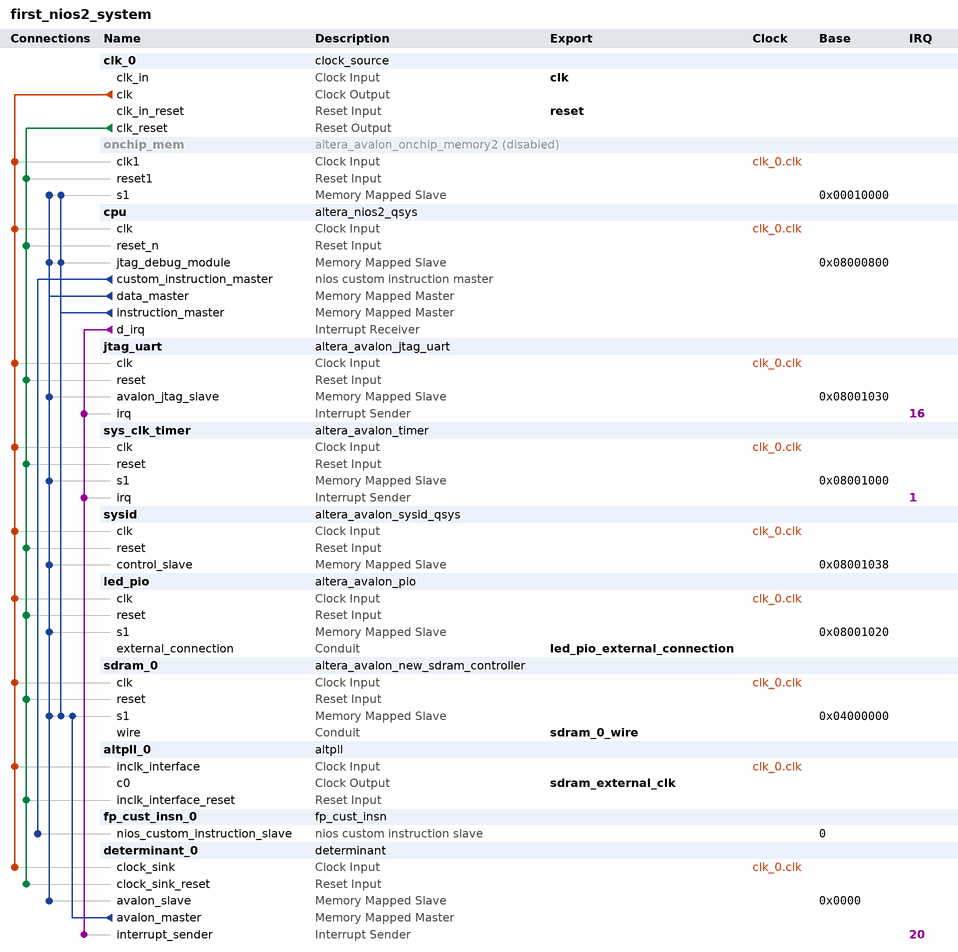
[diagram p0: system contents]
# Platform Designer (Qsys) system first_nios2_system, Cyclone III EP3C16F484C6
# Parameters at their usual value, and those the tool derives, are not listed.
package require -exact qsys 12.1
create_system first_nios2_system
set_project_property DEVICE_FAMILY {Cyclone III}
set_project_property DEVICE EP3C16F484C6

add_instance clk_0 clock_source 12.1
set_instance_parameter_value clk_0 clockFrequency 50000000

add_instance onchip_mem altera_avalon_onchip_memory2 12.1
set_instance_property onchip_mem ENABLED false
set_instance_parameter_value onchip_mem dataWidth 32
set_instance_parameter_value onchip_mem dualPort false
set_instance_parameter_value onchip_mem initMemContent true
set_instance_parameter_value onchip_mem initializationFileName onchip_mem
set_instance_parameter_value onchip_mem memorySize 20480

add_instance cpu altera_nios2_qsys 12.1
set_instance_parameter_value cpu resetSlave sdram_0.s1
set_instance_parameter_value cpu exceptionSlave sdram_0.s1
set_instance_parameter_value cpu breakSlave cpu.jtag_debug_module
set_instance_parameter_value cpu impl Small
set_instance_parameter_value cpu icache_size 2048

add_instance jtag_uart altera_avalon_jtag_uart 12.1
set_instance_parameter_value jtag_uart simInteractiveOptions INTERACTIVE_ASCII_OUTPUT

add_instance sys_clk_timer altera_avalon_timer 12.1
set_instance_parameter_value sys_clk_timer period 1
set_instance_parameter_value sys_clk_timer periodUnits MSEC
set_instance_parameter_value sys_clk_timer timerPreset FULL_FEATURED

add_instance sysid altera_avalon_sysid_qsys 12.1
set_instance_parameter_value sysid id 0

add_instance led_pio altera_avalon_pio 12.1
set_instance_parameter_value led_pio direction Output
set_instance_parameter_value led_pio width 10

add_instance sdram_0 altera_avalon_new_sdram_controller 12.1
set_instance_parameter_value sdram_0 TAC 5.5
set_instance_parameter_value sdram_0 TRCD 20.0
set_instance_parameter_value sdram_0 TRP 20.0
set_instance_parameter_value sdram_0 casLatency 3
set_instance_parameter_value sdram_0 columnWidth 8
set_instance_parameter_value sdram_0 dataWidth 16
set_instance_parameter_value sdram_0 generateSimulationModel false
set_instance_parameter_value sdram_0 model custom
set_instance_parameter_value sdram_0 numberOfBanks 4
set_instance_parameter_value sdram_0 numberOfChipSelects 1
set_instance_parameter_value sdram_0 powerUpDelay 100.0
set_instance_parameter_value sdram_0 refreshPeriod 15.625
set_instance_parameter_value sdram_0 rowWidth 12

add_instance altpll_0 altpll 12.1
set_instance_parameter_value altpll_0 INCLK0_INPUT_FREQUENCY 20000
set_instance_parameter_value altpll_0 GATE_LOCK_SIGNAL NO
set_instance_parameter_value altpll_0 VALID_LOCK_MULTIPLIER 1
set_instance_parameter_value altpll_0 INVALID_LOCK_MULTIPLIER 5
set_instance_parameter_value altpll_0 CLK0_MULTIPLY_BY 1
set_instance_parameter_value altpll_0 CLK0_DIVIDE_BY 1
set_instance_parameter_value altpll_0 CLK0_PHASE_SHIFT -2550
set_instance_parameter_value altpll_0 PORT_clk1 PORT_UNUSED
set_instance_parameter_value altpll_0 PORT_clk2 PORT_UNUSED
set_instance_parameter_value altpll_0 PORT_clk3 PORT_UNUSED
set_instance_parameter_value altpll_0 PORT_ARESET PORT_UNUSED
set_instance_parameter_value altpll_0 PORT_LOCKED PORT_UNUSED

add_instance fp_cust_insn_0 fp_cust_insn 1.0
set_instance_parameter_value fp_cust_insn_0 fp_add_latency 7
set_instance_parameter_value fp_cust_insn_0 fp_sub_latency 7
set_instance_parameter_value fp_cust_insn_0 fp_mul_latency 5
set_instance_parameter_value fp_cust_insn_0 add_opcode 0
set_instance_parameter_value fp_cust_insn_0 sub_opcode 1
set_instance_parameter_value fp_cust_insn_0 mul_opcode 2

add_instance determinant_0 determinant 1.0

# connections
add_connection clk_0.clk altpll_0.inclk_interface clock
add_connection clk_0.clk cpu.clk clock
add_connection clk_0.clk determinant_0.clock_sink clock
add_connection clk_0.clk jtag_uart.clk clock
add_connection clk_0.clk led_pio.clk clock
add_connection clk_0.clk onchip_mem.clk1 clock
add_connection clk_0.clk sdram_0.clk clock
add_connection clk_0.clk sys_clk_timer.clk clock
add_connection clk_0.clk sysid.clk clock
add_connection clk_0.clk_reset altpll_0.inclk_interface_reset reset
add_connection clk_0.clk_reset cpu.reset_n reset
add_connection clk_0.clk_reset determinant_0.clock_sink_reset reset
add_connection clk_0.clk_reset jtag_uart.reset reset
add_connection clk_0.clk_reset led_pio.reset reset
add_connection clk_0.clk_reset onchip_mem.reset1 reset
add_connection clk_0.clk_reset sdram_0.reset reset
add_connection clk_0.clk_reset sys_clk_timer.reset reset
add_connection clk_0.clk_reset sysid.reset reset
add_connection cpu.data_master cpu.jtag_debug_module avalon
set_connection_parameter_value cpu.data_master/cpu.jtag_debug_module baseAddress 0x08000800
add_connection cpu.data_master determinant_0.avalon_slave avalon
set_connection_parameter_value cpu.data_master/determinant_0.avalon_slave baseAddress 0x0000
add_connection cpu.data_master jtag_uart.avalon_jtag_slave avalon
set_connection_parameter_value cpu.data_master/jtag_uart.avalon_jtag_slave baseAddress 0x08001030
add_connection cpu.data_master led_pio.s1 avalon
set_connection_parameter_value cpu.data_master/led_pio.s1 baseAddress 0x08001020
add_connection cpu.data_master onchip_mem.s1 avalon
set_connection_parameter_value cpu.data_master/onchip_mem.s1 baseAddress 0x00010000
add_connection cpu.data_master sdram_0.s1 avalon
set_connection_parameter_value cpu.data_master/sdram_0.s1 baseAddress 0x04000000
add_connection cpu.data_master sys_clk_timer.s1 avalon
set_connection_parameter_value cpu.data_master/sys_clk_timer.s1 baseAddress 0x08001000
add_connection cpu.data_master sysid.control_slave avalon
set_connection_parameter_value cpu.data_master/sysid.control_slave baseAddress 0x08001038
add_connection cpu.instruction_master cpu.jtag_debug_module avalon
set_connection_parameter_value cpu.instruction_master/cpu.jtag_debug_module baseAddress 0x08000800
add_connection cpu.instruction_master onchip_mem.s1 avalon
set_connection_parameter_value cpu.instruction_master/onchip_mem.s1 baseAddress 0x00010000
add_connection cpu.instruction_master sdram_0.s1 avalon
set_connection_parameter_value cpu.instruction_master/sdram_0.s1 baseAddress 0x04000000
add_connection determinant_0.avalon_master sdram_0.s1 avalon
set_connection_parameter_value determinant_0.avalon_master/sdram_0.s1 baseAddress 0x04000000
add_connection cpu.d_irq determinant_0.interrupt_sender interrupt
set_connection_parameter_value cpu.d_irq/determinant_0.interrupt_sender irqNumber 20
add_connection cpu.d_irq jtag_uart.irq interrupt
set_connection_parameter_value cpu.d_irq/jtag_uart.irq irqNumber 16
add_connection cpu.d_irq sys_clk_timer.irq interrupt
set_connection_parameter_value cpu.d_irq/sys_clk_timer.irq irqNumber 1
add_connection cpu.custom_instruction_master fp_cust_insn_0.nios_custom_instruction_slave nios_custom_instruction
set_connection_parameter_value cpu.custom_instruction_master/fp_cust_insn_0.nios_custom_instruction_slave CIName fp_cust_insn_0
set_connection_parameter_value cpu.custom_instruction_master/fp_cust_insn_0.nios_custom_instruction_slave baseAddress 0

# exported interfaces
add_interface clk clock sink
set_interface_property clk EXPORT_OF clk_0.clk_in
add_interface reset reset sink
set_interface_property reset EXPORT_OF clk_0.clk_in_reset
add_interface led_pio_external_connection conduit end
set_interface_property led_pio_external_connection EXPORT_OF led_pio.external_connection
add_interface sdram_0_wire conduit end
set_interface_property sdram_0_wire EXPORT_OF sdram_0.wire
add_interface sdram_external_clk clock source
set_interface_property sdram_external_clk EXPORT_OF altpll_0.c0

save_system first_nios2_system.qsys
